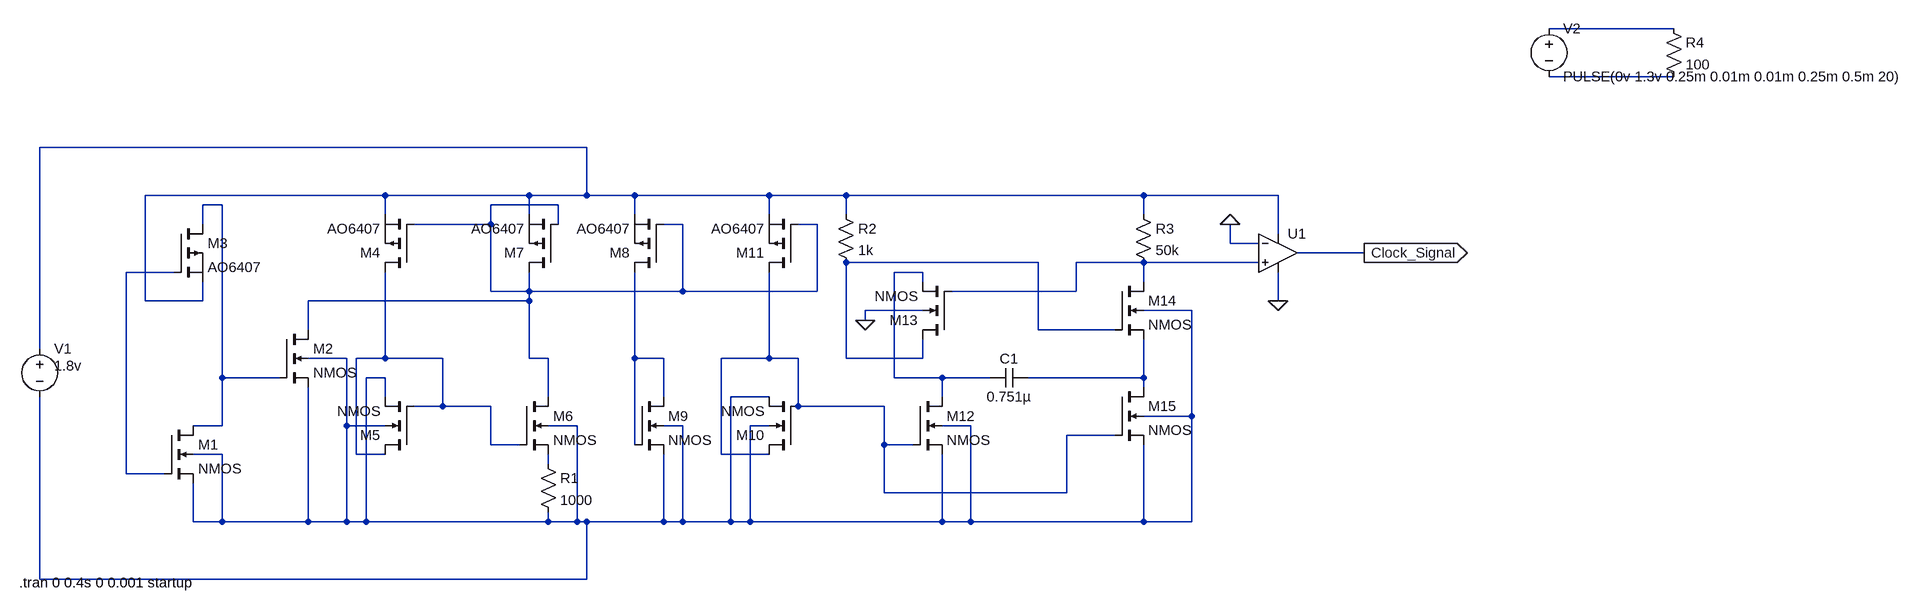
[diagram p0: schematic Clock_Generator.asc]
Clock_Generator.asc, the LTspice schematic file:
Version 4
SHEET 1 4388 680
WIRE 3968 -1424 3760 -1424
WIRE 3968 -1344 3760 -1344
WIRE 768 -272 -144 -272
WIRE 432 -192 32 -192
WIRE 672 -192 432 -192
WIRE 768 -192 768 -272
WIRE 768 -192 672 -192
WIRE 848 -192 768 -192
WIRE 1072 -192 848 -192
WIRE 1200 -192 1072 -192
WIRE 1696 -192 1200 -192
WIRE 1920 -192 1696 -192
WIRE 160 -176 128 -176
WIRE 720 -176 608 -176
WIRE 432 -160 432 -192
WIRE 672 -160 672 -192
WIRE 848 -160 848 -192
WIRE 1072 -160 1072 -192
WIRE 1200 -160 1200 -192
WIRE 1696 -160 1696 -192
WIRE 128 -144 128 -176
WIRE 608 -144 608 -176
WIRE 608 -144 480 -144
WIRE 720 -144 720 -176
WIRE 928 -144 896 -144
WIRE 1152 -144 1120 -144
WIRE 1920 -128 1920 -192
WIRE 1840 -112 1840 -144
WIRE 1888 -112 1840 -112
WIRE 2064 -96 1952 -96
WIRE 1520 -80 1200 -80
WIRE 1696 -80 1584 -80
WIRE 1888 -80 1696 -80
WIRE 80 -64 0 -64
WIRE 1328 -64 1280 -64
WIRE 1328 -48 1328 -64
WIRE 1696 -48 1696 -80
WIRE 608 -32 608 -144
WIRE 672 -32 672 -64
WIRE 672 -32 608 -32
WIRE 928 -32 928 -144
WIRE 928 -32 672 -32
WIRE 1152 -32 1152 -144
WIRE 1152 -32 928 -32
WIRE 1584 -32 1584 -80
WIRE 1584 -32 1376 -32
WIRE 32 -16 32 -192
WIRE 128 -16 128 -48
WIRE 128 -16 32 -16
WIRE 672 -16 672 -32
WIRE 672 -16 304 -16
WIRE 1920 -16 1920 -64
WIRE 1328 0 1232 0
WIRE 1776 0 1696 0
WIRE 1232 16 1232 0
WIRE 304 32 304 -16
WIRE 1520 32 1520 -80
WIRE 1648 32 1520 32
WIRE -144 64 -144 -272
WIRE 368 80 304 80
WIRE 432 80 432 -64
WIRE 432 80 384 80
WIRE 528 80 432 80
WIRE 672 80 672 -16
WIRE 704 80 672 80
WIRE 848 80 848 -64
WIRE 896 80 848 80
WIRE 1072 80 1072 -64
WIRE 1072 80 992 80
WIRE 1120 80 1072 80
WIRE 1200 80 1200 -80
WIRE 1328 80 1328 48
WIRE 1328 80 1200 80
WIRE 160 112 160 -176
WIRE 256 112 160 112
WIRE 432 112 400 112
WIRE 1280 112 1280 -64
WIRE 1360 112 1280 112
WIRE 1440 112 1360 112
WIRE 1696 112 1696 48
WIRE 1696 112 1504 112
WIRE 1696 128 1696 112
WIRE 432 144 432 112
WIRE 704 144 704 80
WIRE 896 144 896 80
WIRE 1072 144 1008 144
WIRE 1360 144 1360 112
WIRE 528 160 528 80
WIRE 528 160 480 160
WIRE 608 160 528 160
WIRE 1120 160 1120 80
WIRE 1264 160 1120 160
WIRE 1776 176 1776 0
WIRE 1776 176 1696 176
WIRE 160 192 160 112
WIRE 160 192 112 192
WIRE 368 192 368 80
WIRE 432 192 368 192
WIRE 752 192 704 192
WIRE 928 192 896 192
WIRE 1072 192 1040 192
WIRE 1408 192 1360 192
WIRE 1648 208 1568 208
WIRE 608 224 608 160
WIRE 656 224 608 224
WIRE 848 224 848 80
WIRE 1264 224 1264 160
WIRE 1312 224 1264 224
WIRE 160 240 112 240
WIRE 384 240 384 80
WIRE 432 240 384 240
WIRE 992 240 992 80
WIRE 1072 240 992 240
WIRE 704 256 704 240
WIRE 0 272 0 -64
WIRE 64 272 0 272
WIRE 1264 304 1264 224
WIRE 1568 304 1568 208
WIRE 1568 304 1264 304
WIRE 112 352 112 288
WIRE 160 352 160 240
WIRE 160 352 112 352
WIRE 304 352 304 128
WIRE 304 352 160 352
WIRE 368 352 368 192
WIRE 368 352 304 352
WIRE 400 352 400 112
WIRE 400 352 368 352
WIRE 704 352 704 336
WIRE 704 352 400 352
WIRE 752 352 752 192
WIRE 752 352 704 352
WIRE 768 352 752 352
WIRE 896 352 896 240
WIRE 896 352 768 352
WIRE 928 352 928 192
WIRE 928 352 896 352
WIRE 1008 352 1008 144
WIRE 1008 352 928 352
WIRE 1040 352 1040 192
WIRE 1040 352 1008 352
WIRE 1360 352 1360 240
WIRE 1360 352 1040 352
WIRE 1408 352 1408 192
WIRE 1408 352 1360 352
WIRE 1696 352 1696 224
WIRE 1696 352 1408 352
WIRE 1776 352 1776 176
WIRE 1776 352 1696 352
WIRE -144 448 -144 144
WIRE 768 448 768 352
WIRE 768 448 -144 448
FLAG 1232 16 0
FLAG 1920 -16 0
FLAG 1840 -144 0
FLAG 2064 -96 Clock_Signal
IOPIN 2064 -96 Out
DATAFLAG -64 -272 ""
DATAFLAG 816 352 ""
DATAFLAG 2000 -96 ""
SYMBOL nmos4 64 192 R0
SYMATTR InstName M1
SYMATTR Value2 l=0.18u w=0.18u
SYMBOL nmos4 256 32 R0
SYMATTR InstName M2
SYMATTR Value2 l=0.18u w=0.18u
SYMBOL pmos 80 -144 R0
SYMATTR InstName M3
SYMATTR Value AO6407
SYMBOL pmos 480 -64 R180
SYMATTR InstName M4
SYMATTR Value AO6407
SYMBOL nmos4 480 240 R180
SYMATTR InstName M5
SYMATTR Value2 l=0.18u w=0.18u
SYMBOL nmos4 656 144 R0
SYMATTR InstName M6
SYMATTR Value2 l=0.18u w=0.18u
SYMBOL pmos 720 -64 R180
SYMATTR InstName M7
SYMATTR Value AO6407
SYMBOL res 688 240 R0
SYMATTR InstName R1
SYMATTR Value 1000
SYMBOL pmos 896 -64 R180
SYMATTR InstName M8
SYMATTR Value AO6407
SYMBOL nmos4 848 144 R0
SYMATTR InstName M9
SYMATTR Value2 l=0.18u w=0.18u
SYMBOL nmos4 1120 240 R180
SYMATTR InstName M10
SYMATTR Value2 l=0.18u w=0.18u
SYMBOL pmos 1120 -64 R180
SYMATTR InstName M11
SYMATTR Value AO6407
SYMBOL nmos4 1312 144 R0
SYMATTR InstName M12
SYMATTR Value2 l=0.18u
SYMBOL nmos4 1376 48 R180
SYMATTR InstName M13
SYMATTR Value2 l=0.18u w=0.18u
SYMBOL cap 1440 128 R270
WINDOW 0 32 32 VTop 2
WINDOW 3 0 32 VBottom 2
SYMATTR InstName C1
SYMATTR Value 0.751µ
SYMBOL res 1184 -176 R0
SYMATTR InstName R2
SYMATTR Value 1k
SYMBOL nmos4 1648 -48 R0
SYMATTR InstName M14
SYMATTR Value2 l=0.18u w=0.18u
SYMBOL nmos4 1648 128 R0
SYMATTR InstName M15
SYMATTR Value2 l=0.18u w=0.18u
SYMBOL res 1680 -176 R0
SYMATTR InstName R3
SYMATTR Value 50k
SYMBOL Opamps\\UniversalOpamp2 1920 -96 R0
SYMATTR InstName U1
SYMBOL voltage -144 48 R0
WINDOW 3 24 44 Left 2
WINDOW 123 0 0 Left 0
WINDOW 39 0 0 Left 0
SYMATTR InstName V1
SYMATTR Value 1.8v
SYMBOL voltage 3760 -1440 R0
WINDOW 123 0 0 Left 0
WINDOW 39 0 0 Left 0
SYMATTR InstName V2
SYMATTR Value PULSE(0v 1.3v 0.25m 0.01m 0.01m 0.25m 0.5m 20)
SYMBOL res 3952 -1440 R0
SYMATTR InstName R4
SYMATTR Value 100
TEXT -178 454 Left 2 !.tran 0 0.4s 0 0.001 startup

The netlist it stands for:
* Clock_Generator.asc
M1 N004 N008 N010 N010 NMOS l=0.18u w=0.18u
M2 N005 N004 N010 N010 NMOS l=0.18u w=0.18u
M3 N004 N008 N003 N003 AO6407
M4 N011 N005 N003 N003 AO6407
M5 N011 N011 N010 N010 NMOS l=0.18u w=0.18u
M6 N005 N011 N015 N010 NMOS l=0.18u w=0.18u
M7 N005 N005 N003 N003 AO6407
R1 N015 N010 1000
M8 N012 N005 N003 N003 AO6407
M9 N012 N012 N010 N010 NMOS l=0.18u w=0.18u
M10 N013 N013 N010 N010 NMOS l=0.18u w=0.18u
M11 N013 N005 N003 N003 AO6407
M12 N009 N013 N010 N010 NMOS l=0.18u
M13 N006 N007 N009 0 NMOS l=0.18u w=0.18u
C1 N009 N014 0.751µ
R2 N003 N006 1k
M14 N007 N006 N014 N010 NMOS l=0.18u w=0.18u
M15 N014 N013 N010 N010 NMOS l=0.18u w=0.18u
R3 N003 N007 50k
XU1 N007 0 N003 0 Clock_Signal level.2 Avol=1Meg GBW=10Meg Slew=10Meg ilimit=25m rail=0 Vos=0 phimargin=45 en=0 enk=0 in=0 ink=0 Rin=500Meg  ; pins IN+ IN- V+ V- OUT
V1 N003 N010 1.8v
V2 N001 N002 PULSE(0v 1.3v 0.25m 0.01m 0.01m 0.25m 0.5m 20)
R4 N001 N002 100
.model NMOS NMOS
.model PMOS PMOS
.lib standard.mos
.tran 0 0.4s 0 0.001 startup
.lib UniversalOpamps2.sub
.backanno
.end